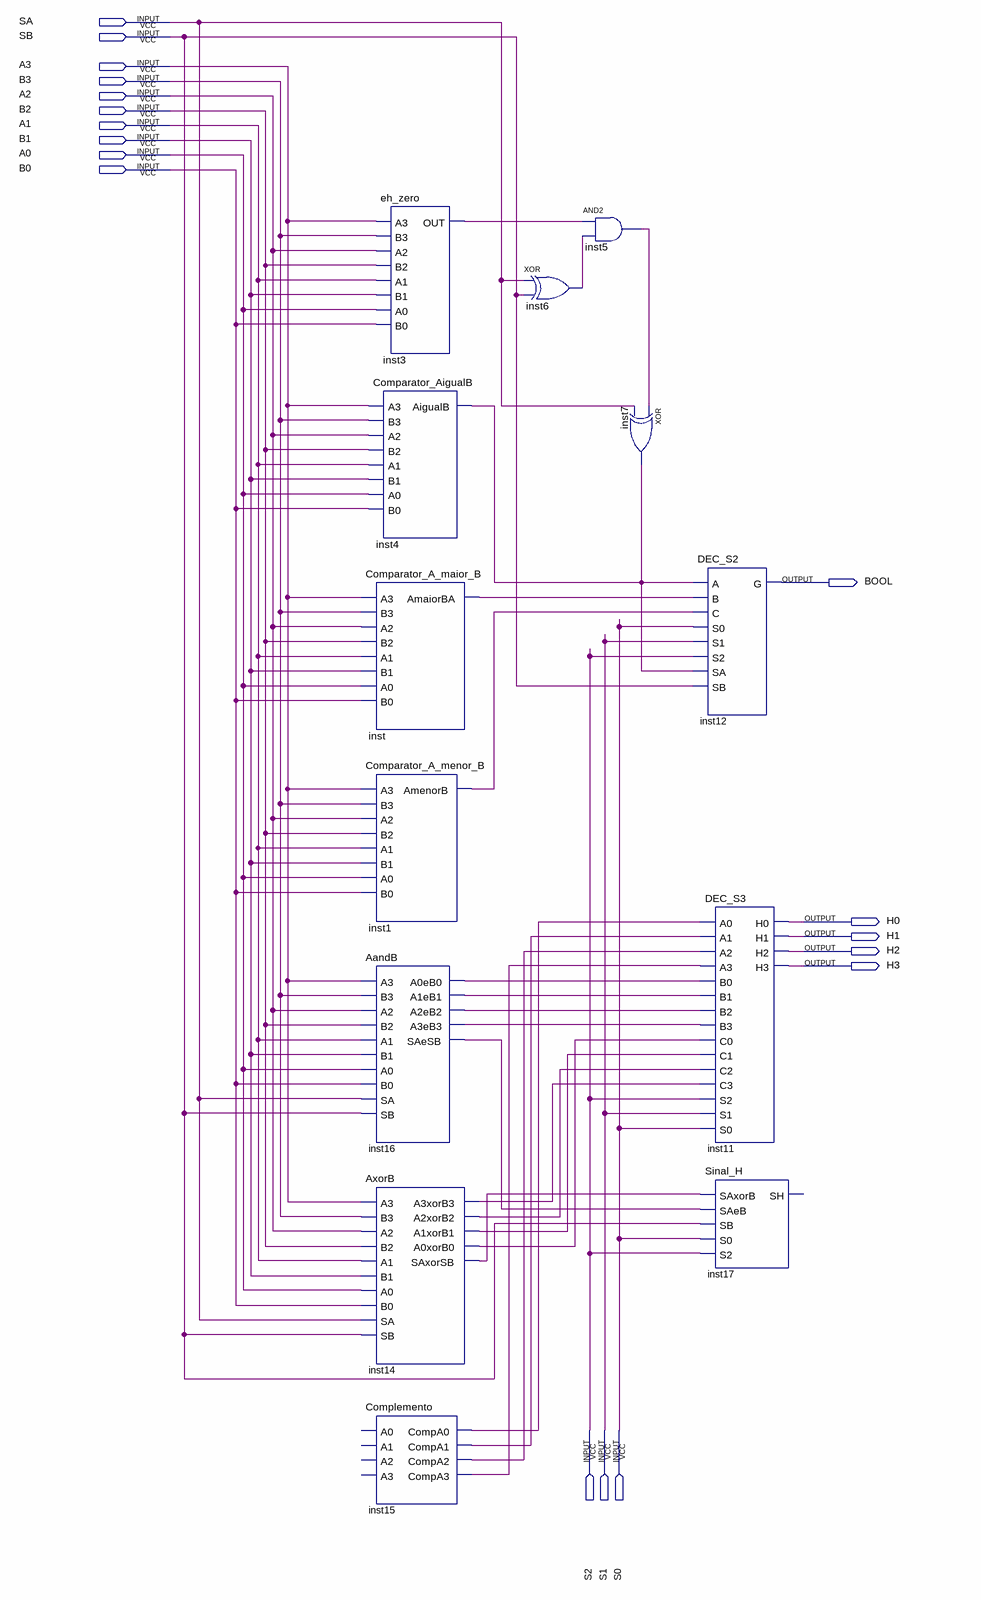
[diagram p0: schematic sheet]
// Quartus schematic Projeto_SD.bdf as structural Verilog: 13 symbols, 18 pins
module Projeto_SD (
  input  SA,
  input  SB,
  input  A3,
  input  B3,
  input  A2,
  input  B2,
  input  A1,
  input  B1,
  input  A0,
  input  B0,
  input  S2,
  input  S1,
  input  S0,
  output BOOL,
  output H0,
  output H1,
  output H2,
  output H3
);

  wire inst1_amenorb, inst3_out, inst4_aigualb, inst5_out, inst6_out, inst14_a0xorb0, inst14_a1xorb1,
       inst14_a2xorb2, inst14_a3xorb3, inst14_saxorsb, inst15_compa0, inst15_compa1, inst15_compa2,
       inst15_compa3, inst16_a0eb0, inst16_a1eb1, inst16_a2eb2, inst16_a3eb3, inst16_saesb, inst_amaiorba;

  eh_zero inst3 (.A0(A0), .A1(A1), .A2(A2), .A3(A3), .B0(B0), .B1(B1), .B2(B2), .B3(B3), .OUT(inst3_out));
  Comparator_AigualB inst4 (
    .A3(A3), .B3(B3), .A2(A2), .B2(B2), .A1(A1), .B1(B1), .A0(A0), .B0(B0), .AigualB(inst4_aigualb));
  Comparator_A_maior_B inst (
    .A3(A3), .B3(B3), .A2(A2), .B2(B2), .A1(A1), .B1(B1), .A0(A0), .B0(B0), .AmaiorBA(inst_amaiorba));
  Comparator_A_menor_B inst1 (
    .A3(A3), .B3(B3), .A2(A2), .B2(B2), .A1(A1), .B1(B1), .A0(A0), .B0(B0), .AmenorB(inst1_amenorb));
  AandB inst16 (
    .A3(A3), .B3(B3), .A2(A2), .B2(B2), .A1(A1), .B1(B1), .A0(A0), .B0(B0), .SA(SA), .SB(SB),
    .A3eB3(inst16_a3eb3), .A2eB2(inst16_a2eb2), .A1eB1(inst16_a1eb1), .A0eB0(inst16_a0eb0),
    .SAeSB(inst16_saesb));
  AxorB inst14 (
    .A3(A3), .B3(B3), .A2(A2), .B2(B2), .A1(A1), .B1(B1), .A0(A0), .B0(B0), .SA(SA), .SB(SB),
    .A3xorB3(inst14_a3xorb3), .A2xorB2(inst14_a2xorb2), .A1xorB1(inst14_a1xorb1), .A0xorB0(inst14_a0xorb0),
    .SAxorSB(inst14_saxorsb));
  Complemento inst15 (
    .CompA0(inst15_compa0), .CompA1(inst15_compa1), .CompA2(inst15_compa2), .CompA3(inst15_compa3));  // open: A0, A1, A2, A3
  xor inst6 (inst6_out, SA, SB);
  and inst5 (inst5_out, inst3_out, inst6_out);
  xor inst7 (inst4_aigualb, inst5_out, SA);
  DEC_S2 inst12 (
    .A(inst4_aigualb), .B(inst_amaiorba), .C(inst1_amenorb), .S0(S0), .S1(S1), .S2(S2), .SA(inst4_aigualb),
    .SB(SB), .G(BOOL));
  DEC_S3 inst11 (
    .A0(inst15_compa0), .A1(inst15_compa1), .A2(inst15_compa2), .A3(inst15_compa3), .B0(inst16_a0eb0),
    .B1(inst16_a1eb1), .B2(inst16_a2eb2), .B3(inst16_a3eb3), .C0(inst14_a0xorb0), .C1(inst14_a1xorb1),
    .C2(inst14_a2xorb2), .C3(inst14_a3xorb3), .S2(S2), .S1(S1), .S0(S0), .H0(H0), .H1(H1), .H2(H2), .H3(H3));
  Sinal_H inst17 (.SAxorB(inst14_saxorsb), .SAeB(inst16_saesb), .SB(SB), .S0(S0), .S2(S2));  // open: SH
endmodule
